# Altium schematic sheet AltiumDesigner - Sheet_2.schdoc
size 88 x 50 mm
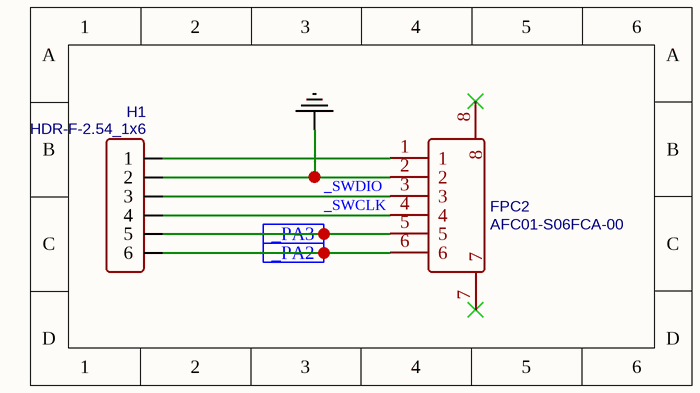
[diagram p0: AltiumDesigner - Sheet_2.schdoc]

## Parts
FPC2  AFC01-S06FCA-00  [FPC-SMD_P0.50-6P_AFC01-S06FCA-00]
H1  HDR-F-2.54_1x6  [HDR-F-2.54_1X6]

## Ports
_PA2 (in), _PA3 (in)

## Nets
_GND: FPC2.2 H1.2
_PA2: FPC2.6 H1.6 ; port _PA2
_PA3: FPC2.5 H1.5 ; port _PA3
_SWCLK: FPC2.4 H1.4
_SWDIO: FPC2.3 H1.3
NetFPC2_1: FPC2.1 H1.1

Not connected (* = marked no-connect by the designer): FPC2 7* 8*

## Library data of the parts
FPC2 = AFC01-S06FCA-00: BOM_Manufacturer: JS(钜硕电子); Contributor: LCSC; BOM_Supplier: LCSC; BOM_Supplier Part: C262655; BOM_Manufacturer Part: AFC01-S06FCA-00; BOM_JLCPCB Part Class: Extended Part; spicePre: F; spiceSymbolName: AFC01-S06FCA-00
H1 = HDR-F-2.54_1x6: Contributor: LCEDA_Lib; BOM_Supplier Part: C40877; BOM_Supplier: LCSC; spicePre: H; spiceSymbolName: HDR-F-2.54_1x6